# Altium project PCB_Project.PrjPcb
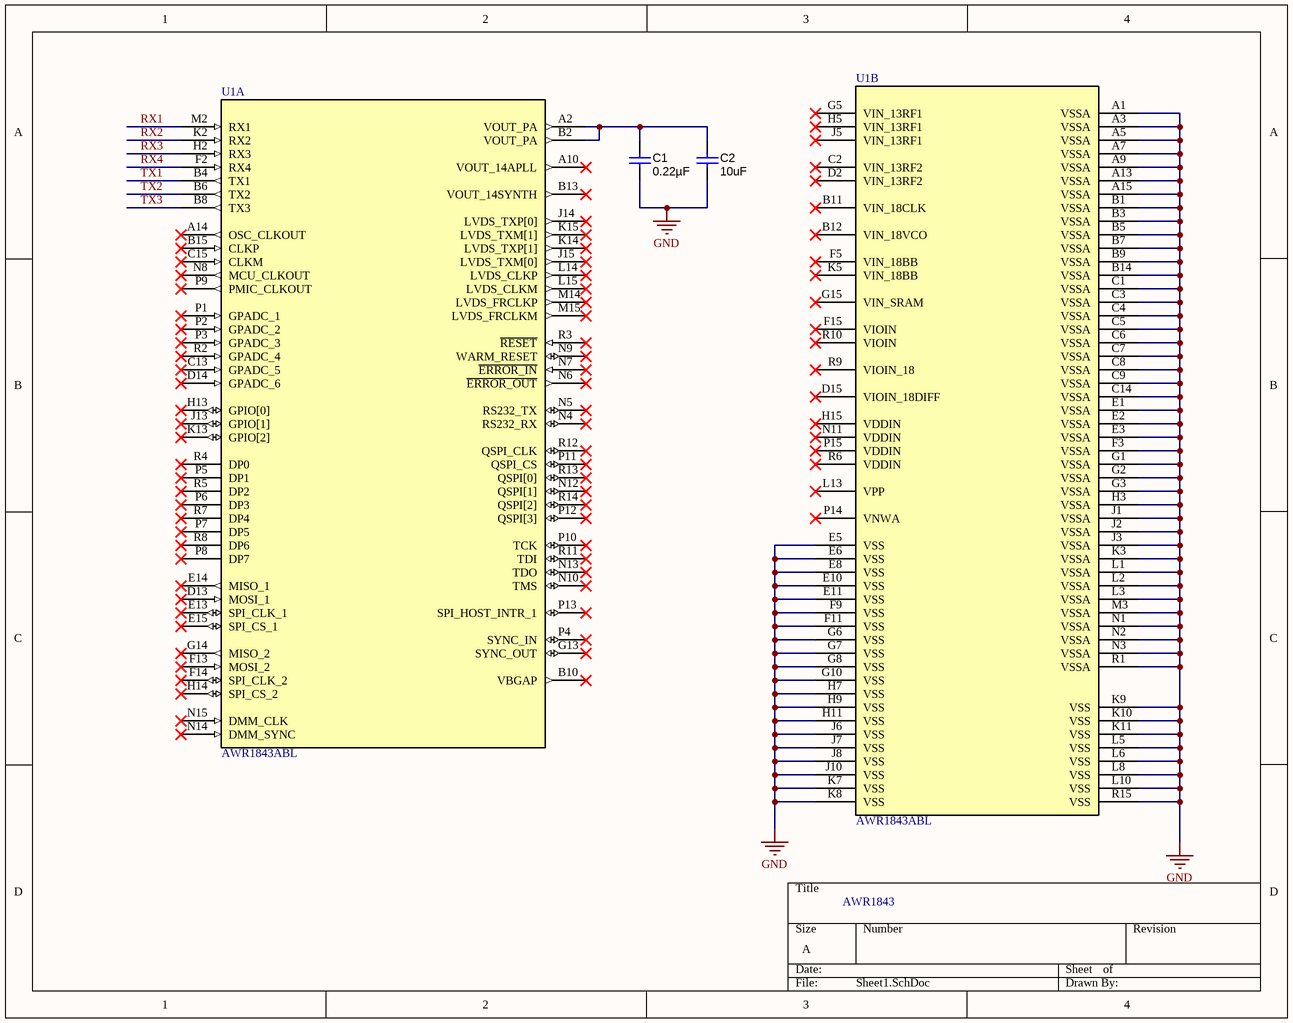
[diagram p0: Sheet1.SchDoc]
1 sheet, 3 parts. Net scope: global (net labels, ports and power ports of the same name join across sheets).
Board file: PCB1.PcbDoc

## Sheet Sheet1.SchDoc
size A; SheetNumber: 1; SheetTotal: 1

### Parts
C1  ValueDisplayed: 0.22µF  [0402L]  (hidden comment: GCM155R71C224KE02D)
C2  ValueDisplayed: 10uF  [0805_HV]  (hidden comment: GCM21BR71A106KE22L)
U1  AWR1843ABL  [ABL0161B]  (parts A,B of 2)

### Nets
GND: C1.2 C2.2 U1.A1(VSSA) U1.A3(VSSA) U1.A5(VSSA) U1.A7(VSSA) U1.A9(VSSA) U1.A13(VSSA) U1.A15(VSSA) U1.B1(VSSA) U1.B3(VSSA) U1.B5(VSSA) U1.B7(VSSA) U1.B9(VSSA) U1.B14(VSSA) U1.C1(VSSA) U1.C3(VSSA) U1.C4(VSSA) U1.C5(VSSA) U1.C6(VSSA) U1.C7(VSSA) U1.C8(VSSA) U1.C9(VSSA) U1.C14(VSSA) U1.E1(VSSA) U1.E2(VSSA) U1.E3(VSSA) U1.E5(VSS) U1.E6(VSS) U1.E8(VSS) U1.E10(VSS) U1.E11(VSS) U1.F3(VSSA) U1.F9(VSS) U1.F11(VSS) U1.G1(VSSA) U1.G2(VSSA) U1.G3(VSSA) U1.G6(VSS) U1.G7(VSS) U1.G8(VSS) U1.G10(VSS) U1.H3(VSSA) U1.H7(VSS) U1.H9(VSS) U1.H11(VSS) U1.J1(VSSA) U1.J2(VSSA) U1.J3(VSSA) U1.J6(VSS) U1.J7(VSS) U1.J8(VSS) U1.J10(VSS) U1.K3(VSSA) U1.K7(VSS) U1.K8(VSS) U1.K9(VSS) U1.K10(VSS) U1.K11(VSS) U1.L1(VSSA) U1.L2(VSSA) U1.L3(VSSA) U1.L5(VSS) U1.L6(VSS) U1.L8(VSS) U1.L10(VSS) U1.M3(VSSA) U1.N1(VSSA) U1.N2(VSSA) U1.N3(VSSA) U1.R1(VSSA) U1.R15(VSS)
RX1: U1.M2(RX1)
RX2: U1.K2(RX2)
RX3: U1.H2(RX3)
RX4: U1.F2(RX4)
TX1: U1.B4(TX1)
TX2: U1.B6(TX2)
TX3: U1.B8(TX3)
NetC1_1: C1.1 C2.1 U1.A2(VOUT_PA) U1.B2(VOUT_PA)

Not connected (* = marked no-connect by the designer): U1 A10(VOUT_14APLL)* A14(OSC_CLKOUT)* B10(VBGAP)* B11(VIN_18CLK)* B12(VIN_18VCO)* B13(VOUT_14SYNTH)* B15(CLKP)* C2(VIN_13RF2)* C13(GPADC_5)* C15(CLKM)* D2(VIN_13RF2)* D13(MOSI_1)* D14(GPADC_6)* D15(VIOIN_18DIFF)* E13(SPI_CLK_1)* E14(MISO_1)* E15(SPI_CS_1)* F5(VIN_18BB)* F13(MOSI_2)* F14(SPI_CLK_2)* F15(VIOIN)* G5(VIN_13RF1)* G13(SYNC_OUT)* G14(MISO_2)* G15(VIN_SRAM)* H5(VIN_13RF1)* H13(GPIO[0])* H14(SPI_CS_2)* H15(VDDIN)* J5(VIN_13RF1)* J13(GPIO[1])* J14(LVDS_TXP[0])* J15(LVDS_TXM[0])* K5(VIN_18BB)* K13(GPIO[2])* K14(LVDS_TXP[1])* K15(LVDS_TXM[1])* L13(VPP)* L14(LVDS_CLKP)* L15(LVDS_CLKM)* M14(LVDS_FRCLKP)* M15(LVDS_FRCLKM)* N4(RS232_RX)* N5(RS232_TX)* N6(~{ERROR_OUT})* N7(~{ERROR_IN})* N8(MCU_CLKOUT)* N9(WARM_RESET)* N10(TMS)* N11(VDDIN)* N12(QSPI[1])* N13(TDO)* N14(DMM_SYNC)* N15(DMM_CLK)* P1(GPADC_1)* P2(GPADC_2)* P3(GPADC_3)* P4(SYNC_IN)* P5(DP1)* P6(DP3)* P7(DP5)* P8(DP7)* P9(PMIC_CLKOUT)* P10(TCK)* P11(QSPI_CS)* P12(QSPI[3])* P13(SPI_HOST_INTR_1)* P14(VNWA)* P15(VDDIN)* R2(GPADC_4)* R3(~{RESET})* R4(DP0)* R5(DP2)* R6(VDDIN)* R7(DP4)* R8(DP6)* R9(VIOIN_18)* R10(VIOIN)* R11(TDI)* R12(QSPI_CLK)* R13(QSPI[0])* R14(QSPI[2])*

### Notes on the sheet
- AWR1843

### Library data of the parts
C1 = CMP-0078265-1: CAP, CERM, 0.22 µF, 16 V,+/- 10%, X7R, AEC-Q200 Grade 1, 0402; Manufacturer: MuRata; TaMin_C: -55°C; Polarized: N; SizeAreaWB_mm2: 3; U/M: EA; Value: 0.22uF; TaMax_C: 125°C; SizeZ_mm: 0.6; SizeX_mm: 1; SizeY_mm: 0.5; Cap_Case: 0402; Value2: 16V; CompType: Capacitor; AEC Qualified: Y; Cap_F: 220nF; AEC Category: Q200; ComponentLink1URL: http://psearch.en.murata.com/capacitor/product/GCM155R71C224KE02%23.pdf; Supplier Part Number 2: 81-GCM155R71C224KE2D; Supplier 2: Mouser; TempCo: X7R; RoHS: Y; MountType: SMT; Supplier 1: Digi-Key; PackageReference: 0402; Tolerance_%: 10%; SizeArea_mm2: 0.5; PartNumber: GCM155R71C224KE02D; VDC_V: 16V; ComponentLink1Description: Datasheet link; AEC Grade: 1; Supplier Part Number 1: 490-10671-1-ND; Technology: Ceramic
C2 = CMP-0008017-2: CAP, CERM, 10 uF, 10 V, +/- 10%, X7R, 0805; Manufacturer: MuRata; TaMin_C: -55°C; Polarized: N; SizeAreaWB_mm2: 6.75; Value1: Unknown; U/M: EA; Value: 10uF; TaMax_C: 125°C; SizeZ_mm: 1.45; SizeX_mm: 2; SizeY_mm: 1.25; Cap_Case: 0805; Value2: 10V; SizeArea_mm2: 2.5; CompType: Capacitor; Cap_F: 10µF; AEC Category: Q200; Supplier Part Number 2: 06AC6014; Publisher: Texas Instruments; Supplier 2: Newark; Supplier Part Number 3: 81-GCM21BR71A106KE2L; TempCo: X7R; Supplier 3: Mouser; Published: 2008-06-19; RoHS: Y; MountType: SMT; Supplier 1: Digi-Key; PackageReference: 0805; Tolerance_%: 10%; LatestRevisionDate: 2017-03-09; PartNumber: GCM21BR71A106KE22L; AEC Qualified: ?; VDC_V: 10V; ComponentLink1Description: Datasheet link; Supplier Part Number 1: 490-10674-1-ND; Technology: Ceramic; ComponentLink1URL: http://www.murata.com/products/catalog/pdf/c03e.pdf
U1 = CMP-0078239-1: AWR1843ABL, ABL0161B (FCBGA-161); Manufacturer: Texas Instruments; AEC Qualified: N; SizeArea_mm2: 108.16; CompType: IC; SizeAreaWB_mm2: 153.76; AEC Category: Q200; SizeY_mm: 10.4; SizeZ_mm: 1.17; ComponentLink2Description: Product Folder; PackageDescription: FCBGA-161; PackageReference: ABL0161B; ComponentLink1Description: Datasheet Link; MountType: SMT; ComponentLink1URL: https://sps16.itg.ti.com/sites/KMS/crossdivteams/altium/docs/AWR1843_ballout_05Sep17.xlsx; ComponentLink2URL: TBD; Alternate Manufacturer: Texas Instruments; SizeX_mm: 10.4; PartId: 1; PartNumber: AWR1843ABL